# EAGLE schematic MSP430 (EAGLE 6.4)
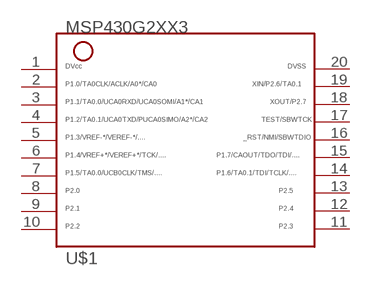
[diagram p0: schematic, sheet 1]

## Parts
U$1  G2XX3---PW20  [PW20]
Unconnected: U$1.1 U$1.2 U$1.3 U$1.4 U$1.5 U$1.6 U$1.7 U$1.8 U$1.9 U$1.10 U$1.11 U$1.12 U$1.13 U$1.14 U$1.15 U$1.16 U$1.17 U$1.18 U$1.19 U$1.20

## Library data of the parts
U$1 = TI_MSP430_v16:G2XX3---PW20: MSP430G2XX1 TSSOP (PW) 20 Pin Package